# Altium schematic sheet Interfaces.SchDoc
size 594 x 420 mm; SheetNumber: 5; PageSetup: Record=PageOptions|CenterHorizontal=False|CenterVertical=False|PrintScale=0.43|XCorrection=0.00|YCorrection=0.00|PrintKind=1|BorderSize=5000000|LeftOffset=0|BottomOffset=0|Orientation=2|PaperLength=5940|PaperWidth=4200|Scale=100|PaperSource=7|PrintQuality=-4|MediaType=1|DitherType=10|PaperKind=Personal. 1: 215,9 x 279,4 mm|PrintScaleMode=0
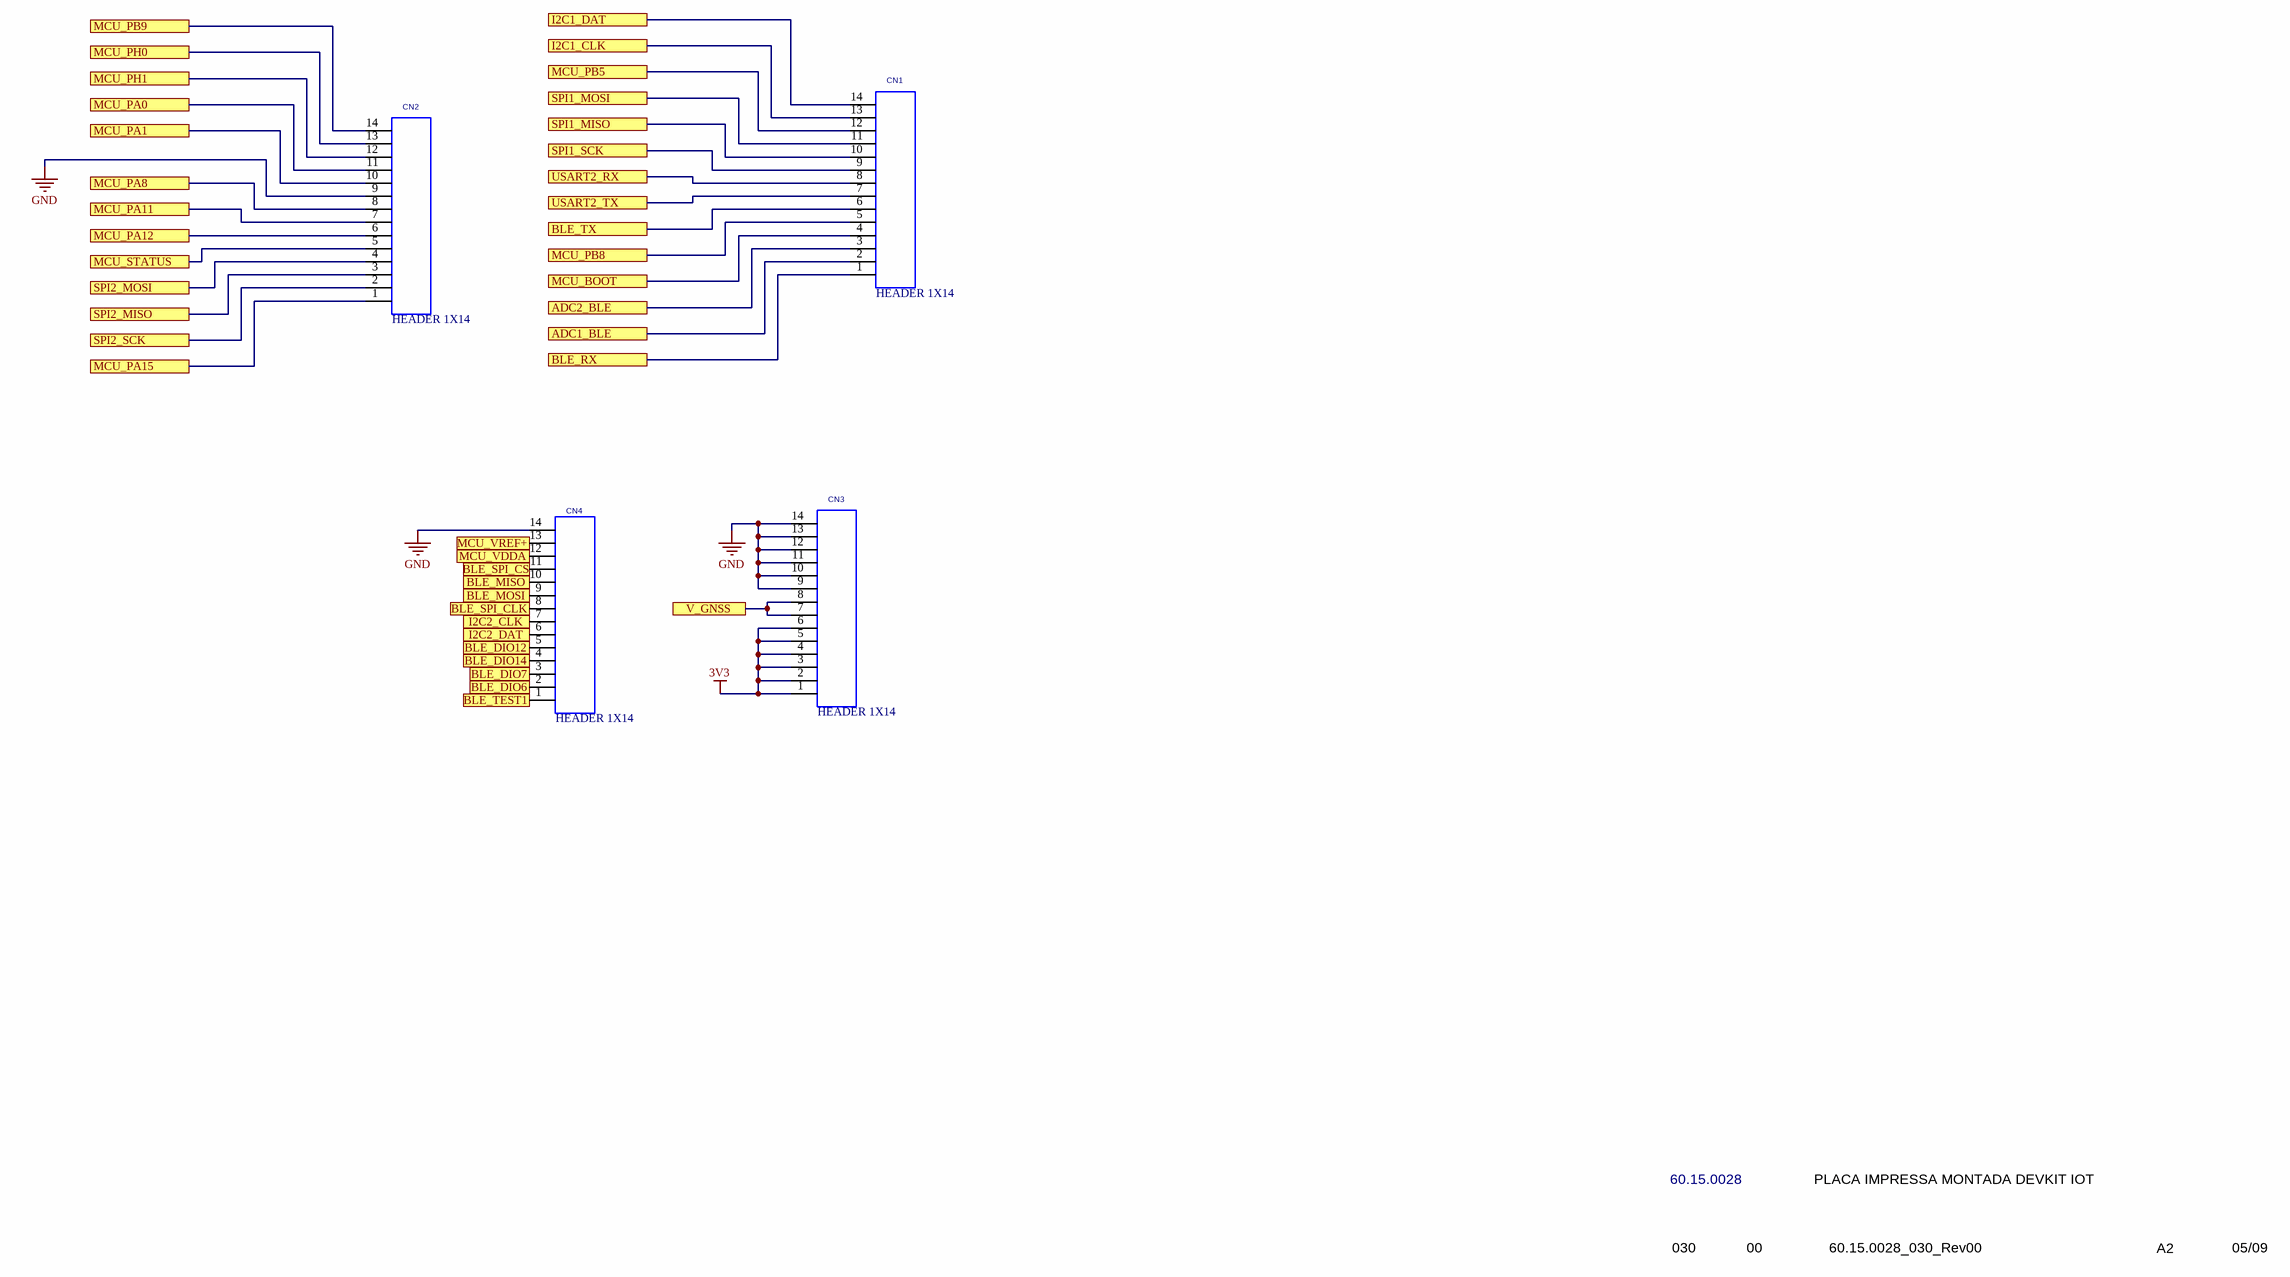
[diagram p0: Interfaces.SchDoc]

## Parts
CN1  28.14.0551  [28.14.0551]  (value not drawn)
CN2  28.14.0551  [28.14.0551]  (value not drawn)
CN3  28.14.0551  [28.14.0551]  (value not drawn)
CN4  28.14.0551  [28.14.0551]  (value not drawn)

## Ports
ADC1_BLE, ADC2_BLE, BLE_DIO6, BLE_DIO7, BLE_DIO12, BLE_DIO14, BLE_MISO, BLE_MOSI, BLE_RX, BLE_SPI_CLK, BLE_SPI_CS, BLE_TEST1, BLE_TX, I2C1_CLK, I2C1_DAT, I2C2_CLK, I2C2_DAT, MCU_BOOT, MCU_PA0, MCU_PA1, MCU_PA8, MCU_PA11, MCU_PA12, MCU_PA15, MCU_PB5, MCU_PB8, MCU_PB9, MCU_PH0, MCU_PH1, MCU_STATUS, MCU_VDDA, MCU_VREF+, SPI1_MISO, SPI1_MOSI, SPI1_SCK, SPI2_MISO, SPI2_MOSI, SPI2_SCK, USART2_RX, USART2_TX, V_GNSS

## Nets
3V3: CN3.1 CN3.2 CN3.3 CN3.4 CN3.5 CN3.6
GND: CN2.9 CN3.9 CN3.10 CN3.11 CN3.12 CN3.13 CN3.14 CN4.14
ADC1_BLE: CN1.2 ; port ADC1_BLE
ADC2_BLE: CN1.3 ; port ADC2_BLE
BLE_DIO6: CN4.2 ; port BLE_DIO6
BLE_DIO7: CN4.3 ; port BLE_DIO7
BLE_DIO12: CN4.5 ; port BLE_DIO12
BLE_DIO14: CN4.4 ; port BLE_DIO14
BLE_MISO: CN4.10 ; port BLE_MISO
BLE_MOSI: CN4.9 ; port BLE_MOSI
BLE_RX: CN1.1 ; port BLE_RX
BLE_SPI_CLK: CN4.8 ; port BLE_SPI_CLK
BLE_SPI_CS: CN4.11 ; port BLE_SPI_CS
BLE_TEST1: CN4.1 ; port BLE_TEST1
BLE_TX: CN1.6 ; port BLE_TX
I2C1_CLK: CN1.13 ; port I2C1_CLK
I2C1_DAT: CN1.14 ; port I2C1_DAT
I2C2_CLK: CN4.7 ; port I2C2_CLK
I2C2_DAT: CN4.6 ; port I2C2_DAT
MCU_BOOT: CN1.4 ; port MCU_BOOT
MCU_PA0: CN2.11 ; port MCU_PA0
MCU_PA1: CN2.10 ; port MCU_PA1
MCU_PA8: CN2.8 ; port MCU_PA8
MCU_PA11: CN2.7 ; port MCU_PA11
MCU_PA12: CN2.6 ; port MCU_PA12
MCU_PA15: CN2.1 ; port MCU_PA15
MCU_PB5: CN1.12 ; port MCU_PB5
MCU_PB8: CN1.5 ; port MCU_PB8
MCU_PB9: CN2.14 ; port MCU_PB9
MCU_PH0: CN2.13 ; port MCU_PH0
MCU_PH1: CN2.12 ; port MCU_PH1
MCU_STATUS: CN2.5 ; port MCU_STATUS
MCU_VDDA: CN4.12 ; port MCU_VDDA
MCU_VREF+: CN4.13 ; port MCU_VREF+
SPI1_MISO: CN1.10 ; port SPI1_MISO
SPI1_MOSI: CN1.11 ; port SPI1_MOSI
SPI1_SCK: CN1.9 ; port SPI1_SCK
SPI2_MISO: CN2.3 ; port SPI2_MISO
SPI2_MOSI: CN2.4 ; port SPI2_MOSI
SPI2_SCK: CN2.2 ; port SPI2_SCK
USART2_RX: CN1.8 ; port USART2_RX
USART2_TX: CN1.7 ; port USART2_TX
V_GNSS: CN3.7 CN3.8 ; port V_GNSS

## Notes on the sheet
- 60.15.0028
- PLACA IMPRESSA MONTADA DEVKIT IOT
- 030
- 00
- 60.15.0028_030_Rev00
- A2
- 05/09
- 1
- 2
- 3
- 4
- 5
- 6
- 7
- 8
- A
- B
- C
- D
- E
- F
- G
- H
- DOCUMENTO DE ENGENHARIA DE PRODUTO
- DOCUMENT OF PRODUCT ENGINEERING
- CÓDIGO / CODE
- DESCRIÇÃO / DESCRIPTION
- DOC
- REV
- ARQUIVO / FILE
- FORM./SIZE
- FOLHA / PAGE
- (in symbol 28.14.0551) HEADER 1X14

## Library data of the parts
CN1-CN4 = 28.14.0551: CONECTOR HEADER FM 14 VIAS 180G P/PCB